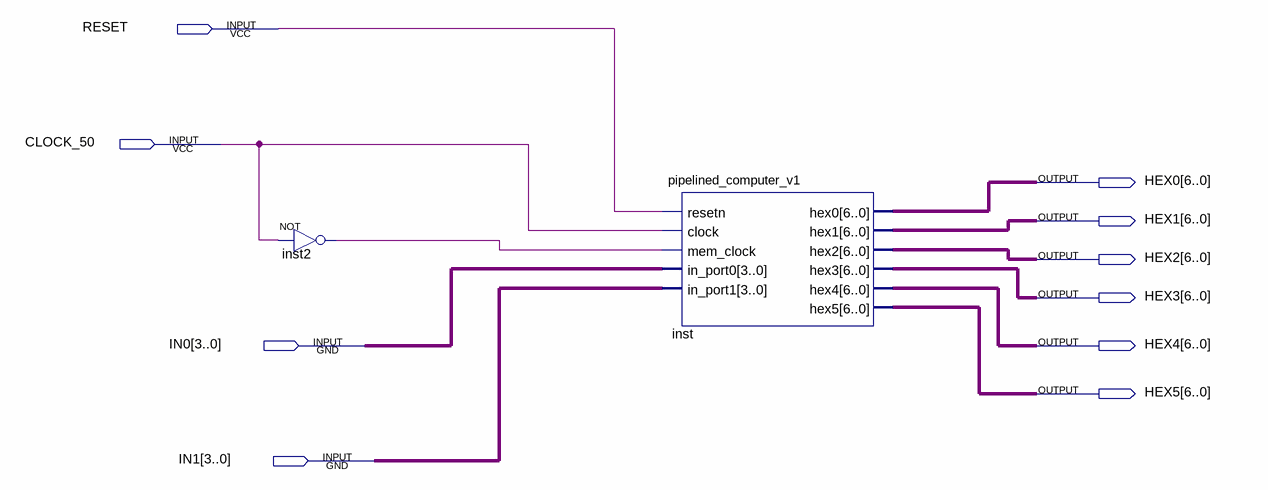
[diagram p0: schematic sheet]
// Quartus schematic ppl_cpu2.bdf as structural Verilog: 2 symbols, 10 pins
module ppl_cpu2 (
  input  RESET,
  input  CLOCK_50,
  input  [3:0] IN0,
  input  [3:0] IN1,
  output [6:0] HEX0,
  output [6:0] HEX1,
  output [6:0] HEX2,
  output [6:0] HEX3,
  output [6:0] HEX4,
  output [6:0] HEX5
);

  wire inst2_out;

  not inst2 (inst2_out, CLOCK_50);
  pipelined_computer_v1 inst (
    .resetn(RESET), .clock(CLOCK_50), .mem_clock(inst2_out), .in_port0(IN0), .in_port1(IN1), .hex0(HEX0),
    .hex1(HEX1), .hex2(HEX2), .hex3(HEX3), .hex4(HEX4), .hex5(HEX5));
endmodule
